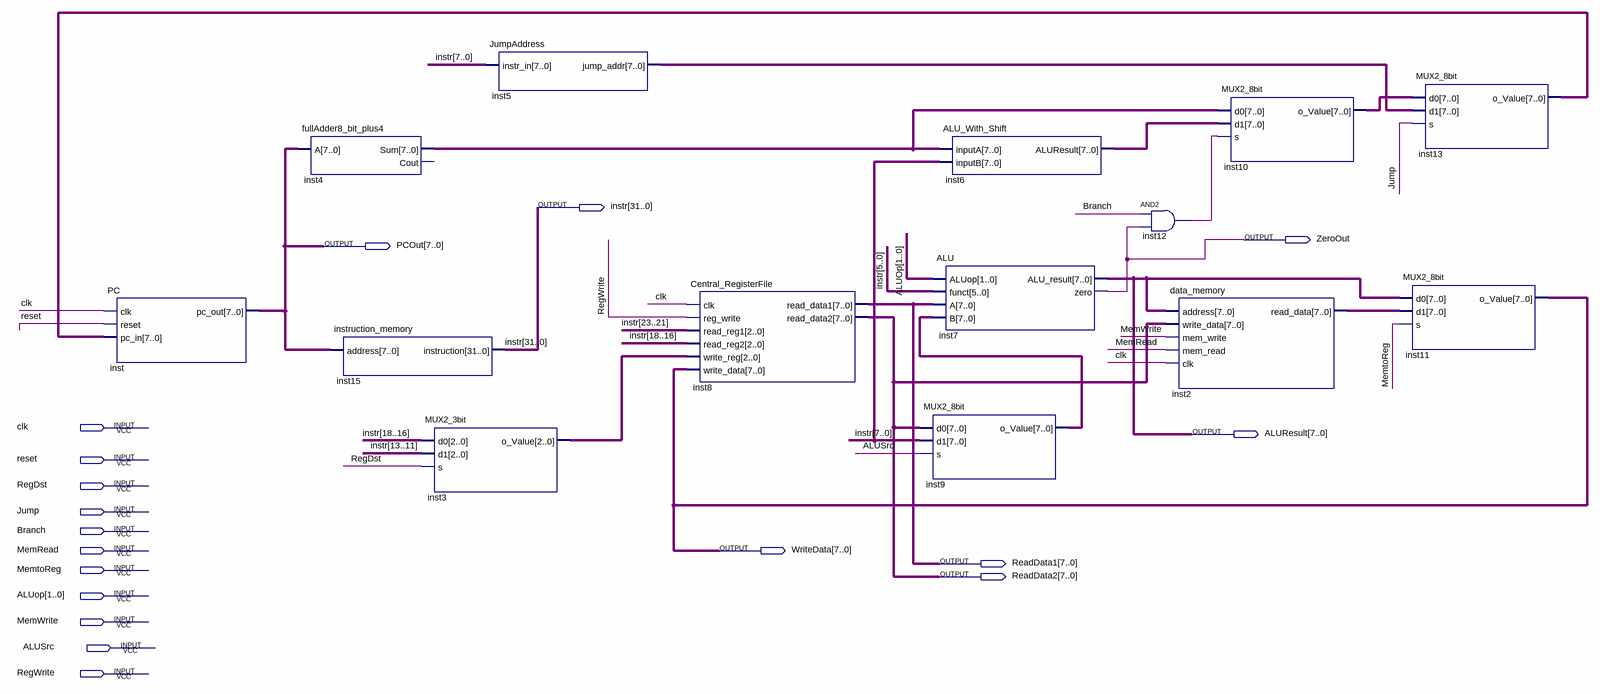
[diagram p0: schematic sheet]
// Quartus schematic DATAPATH.bdf as structural Verilog: 14 symbols, 18 pins
module DATAPATH (
  input  clk,
  input  reset,
  input  RegDst,
  input  Jump,
  input  Branch,
  input  MemRead,
  input  MemtoReg,
  input  [1:0] ALUop,
  input  MemWrite,
  input  ALUSrc,
  input  RegWrite,
  output [31:0] instr,
  output ZeroOut,
  output [7:0] PCOut,
  output [7:0] ALUResult,
  output [7:0] WriteData,
  output [7:0] ReadData1,
  output [7:0] ReadData2
);

  wire inst12_out;
  wire [2:0] inst3_o_value;
  wire [7:0] inst2_read_data, inst4_sum, inst5_jump_addr, inst6_aluresult, inst9_o_value, inst10_o_value,
       inst13_o_value;

  PC inst (.clk(clk), .reset(reset), .pc_in(inst13_o_value), .pc_out(PCOut));
  fullAdder8_bit_plus4 inst4 (.A(PCOut), .Sum(inst4_sum));  // open: Cout
  instruction_memory inst15 (.address(PCOut), .instruction(instr));
  MUX2_3bit inst3 (.d0(instr[18:16]), .d1(instr[13:11]), .s(RegDst), .o_Value(inst3_o_value));
  JumpAddress inst5 (.instr_in(instr[7:0]), .jump_addr(inst5_jump_addr));
  Central_RegisterFile inst8 (
    .clk(clk), .reg_write(RegWrite), .read_reg1(instr[23:21]), .read_reg2(instr[18:16]),
    .write_reg(inst3_o_value), .write_data(WriteData), .read_data1(ReadData1), .read_data2(ReadData2));
  MUX2_8bit inst9 (.d0(ReadData2), .d1(instr[7:0]), .s(ALUSrc), .o_Value(inst9_o_value));
  ALU_With_Shift inst6 (.inputA(inst4_sum), .inputB(instr[7:0]), .ALUResult(inst6_aluresult));
  ALU inst7 (
    .ALUop(ALUop), .funct(instr[5:0]), .A(ReadData1), .B(inst9_o_value), .ALU_result(ALUResult),
    .zero(ZeroOut));
  and inst12 (inst12_out, Branch, ZeroOut);
  data_memory inst2 (
    .address(ALUResult), .write_data(ReadData2), .mem_write(MemWrite), .mem_read(MemRead), .clk(clk),
    .read_data(inst2_read_data));
  MUX2_8bit inst10 (.d0(inst4_sum), .d1(inst6_aluresult), .s(inst12_out), .o_Value(inst10_o_value));
  MUX2_8bit inst13 (.d0(inst10_o_value), .d1(inst5_jump_addr), .s(Jump), .o_Value(inst13_o_value));
  MUX2_8bit inst11 (.d0(ALUResult), .d1(inst2_read_data), .s(MemtoReg), .o_Value(WriteData));
endmodule
